# Altium project ElemoW12S-01.PrjPcb
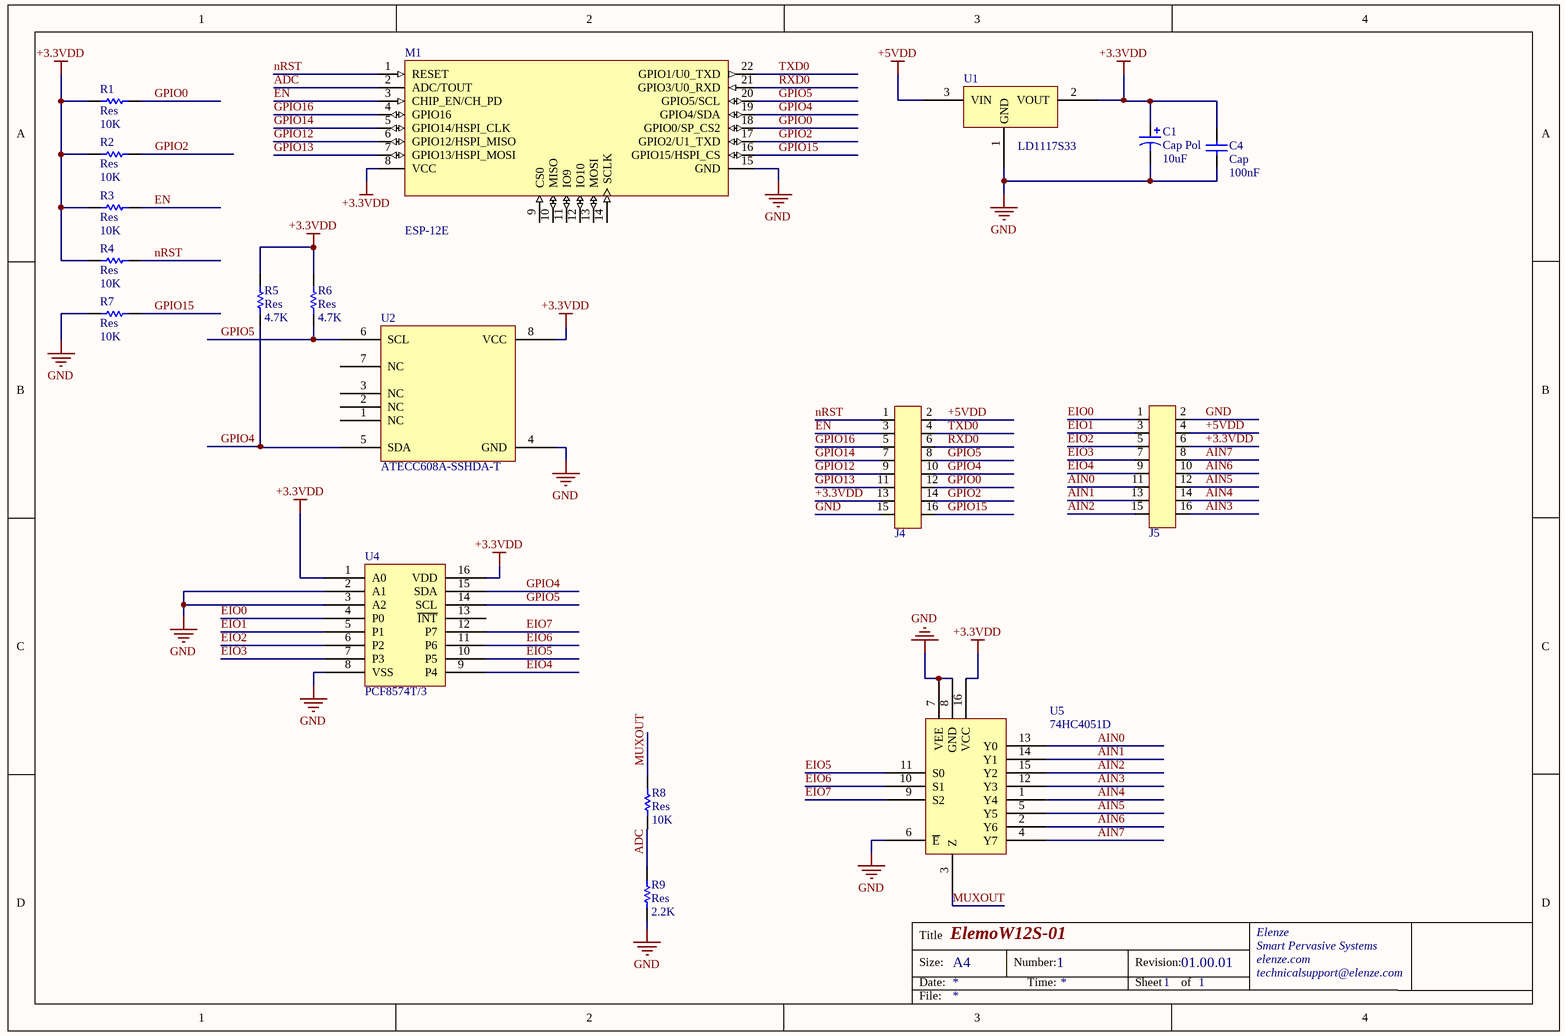
[diagram p0: ElemoW12S-01.SchDoc]
1 sheet, 18 parts. Net scope: global (net labels, ports and power ports of the same name join across sheets).
Board file: ElemoW12S-01.PcbDoc

## Sheet ElemoW12S-01.SchDoc: ElemoW12S-01
size A4; Organization: Elenze; Address1: Smart Pervasive Systems; Address2: elenze.com; Address3: technicalsupport@elenze.com; DocumentNumber: 1; Revision: 01.00.01; SheetNumber: 1; SheetTotal: 1

### Parts
C1  Cap Pol  value 10uF  [1206P]
C4  Cap  value 100nF  [0402]
J4  2x8 PIN HEADER  [HDR_2X8_1.27_SMT]  (value not drawn)
J5  2x8 PIN HEADER  [HDR_2X8_1.27_SMT]  (value not drawn)
M1  ESP-12E  [ESP8266-12E]
R1  Res  value 10K  [0402]
R2  Res  value 10K  [0402]
R3  Res  value 10K  [0402]
R4  Res  value 10K  [0402]
R5  Res  value 4.7K  [0402]
R6  Res  value 4.7K  [0402]
R7  Res  value 10K  [0402]
R8  Res  value 10K  [0402]
R9  Res  value 2.2K  [0402]
U1  LD1117S33  [SOT223_4]
U2  ATECC608A-SSHDA-T  [SO_8N]
U4  PCF8574T/3  [SO_16W]
U5  74HC4051D  [SO_16N]

### Nets
+3.3VDD: C1.1 C4.2 J4.13 J5.6 M1.8(VCC) R1.1 R2.1 R3.1 R4.1 R5.2 R6.2 U1.2(VOUT) U2.8(VCC) U4.1(A0) U4.16(VDD) U5.16(VCC)
+5VDD: J4.2 J5.4 U1.3(VIN)
GND: C1.2 C4.1 J4.15 J5.2 M1.15(GND) R7.1 R9.1 U1.1(GND) U2.4(GND) U4.2(A1) U4.3(A2) U4.8(VSS) U5.6(~{E}) U5.7(VEE) U5.8(GND)
ADC: M1.2(ADC/TOUT) R8.1 R9.2
AIN0: J5.11 U5.13(Y0)
AIN1: J5.13 U5.14(Y1)
AIN2: J5.15 U5.15(Y2)
AIN3: J5.16 U5.12(Y3)
AIN4: J5.14 U5.1(Y4)
AIN5: J5.12 U5.5(Y5)
AIN6: J5.10 U5.2(Y6)
AIN7: J5.8 U5.4(Y7)
EIO0: J5.1 U4.4(P0)
EIO1: J5.3 U4.5(P1)
EIO2: J5.5 U4.6(P2)
EIO3: J5.7 U4.7(P3)
EIO4: J5.9 U4.9(P4)
EIO5: U4.10(P5) U5.11(S0)
EIO6: U4.11(P6) U5.10(S1)
EIO7: U4.12(P7) U5.9(S2)
EN: J4.3 M1.3(CHIP_EN/CH_PD) R3.2
GPIO0: J4.12 M1.18(GPIO0/SP_CS2) R1.2
GPIO2: J4.14 M1.17(GPIO2/U1_TXD) R2.2
GPIO4: J4.10 M1.19(GPIO4/SDA) R5.1 U2.5(SDA) U4.15(SDA)
GPIO5: J4.8 M1.20(GPIO5/SCL) R6.1 U2.6(SCL) U4.14(SCL)
GPIO12: J4.9 M1.6(GPIO12/HSPI_MISO)
GPIO13: J4.11 M1.7(GPIO13/HSPI_MOSI)
GPIO14: J4.7 M1.5(GPIO14/HSPI_CLK)
GPIO15: J4.16 M1.16(GPIO15/HSPI_CS) R7.2
GPIO16: J4.5 M1.4(GPIO16)
MUXOUT: R8.2 U5.3(Z)
nRST: J4.1 M1.1(RESET) R4.2
RXD0: J4.6 M1.21(GPIO3/U0_RXD)
TXD0: J4.4 M1.22(GPIO1/U0_TXD)

Not connected (* = marked no-connect by the designer): M1 9(CS0) 10(MISO) 11(IO9) 12(IO10) 13(MOSI) 14(SCLK); U2 1(NC) 2(NC) 3(NC) 7(NC); U4 13(~{INT})

### Notes on the sheet
- Title
- Size:
- Date:
- A4
- Number:
- Time:
- Revision:
- Sheet
- of
- File:

### Library data of the parts
C1 = Cap Pol: Polarized Capacitor (Axial); Published: 8-Jun-2000; LatestRevisionDate: 17-Jul-2002; LatestRevisionNote: Re-released for DXP Platform.; PackageReference: POLAR0.8; Publisher: Altium Limited; PackageDescription: Polarized Capacitor; 2 Leads
C4 = Cap: Capacitor; Published: 8-Jun-2000; LatestRevisionDate: 17-Jul-2002; LatestRevisionNote: Re-released for DXP Platform.; PackageReference: RAD-0.3; Publisher: Altium Limited; PackageDescription: Radial Cap, Thru-Hole; 2 Leads; 0.3 in Pin Spacing
J4 J5 = HEADER2x8
M1 = ESP-12E: ESP-12F WiFi module - developed by Ai-thinker Team
R1-R9 = Res: Resistor; Published: 8-Jun-2000; LatestRevisionDate: 17-Jul-2002; LatestRevisionNote: Re-released for DXP Platform.; PackageReference: AXIAL-0.3; Publisher: Altium Limited; PackageDescription: Axial Device, Thru-Hole; 2 Leads; 0.3 in Pin Spacing
U1 = LD1117S33CTR: IC REG LINEAR 3.3V 800MA; Manufacturer: STMicroelectronics; Part Number: LD1117S33CTR; Package: SOT223
U2 = ATECC608A-SSHDA-T: IC AUTHENTICATION CHIP 8SOIC; MF: Microchip; Check_prices: https://www.snapeda.com/parts/ATECC608A-SSHDA-T/Microchip/view-part/2888503/?ref=eda; Availability: Warning; Price: None; Package: SO-8 Microchip; Value: *; Purchase-URL: https://pricing.snapeda.com/search/part/ATECC608A-SSHDA-T/?ref=eda; SnapEDA_Link: https://www.snapeda.com/parts/ATECC608A-SSHDA-T/Microchip/view-part/2888503/?ref=snap; MP: ATECC608A-SSHDA-T
U4 = PCF8574T/3: I2C IO Expander
U5 = 74HC4051D: CMOS ANALOG/DIGITAL MUX/DEMUX